# Altium schematic sheet DAC_OutFilter.SchDoc
size A4; SheetNumber: 7; SheetTotal: 8
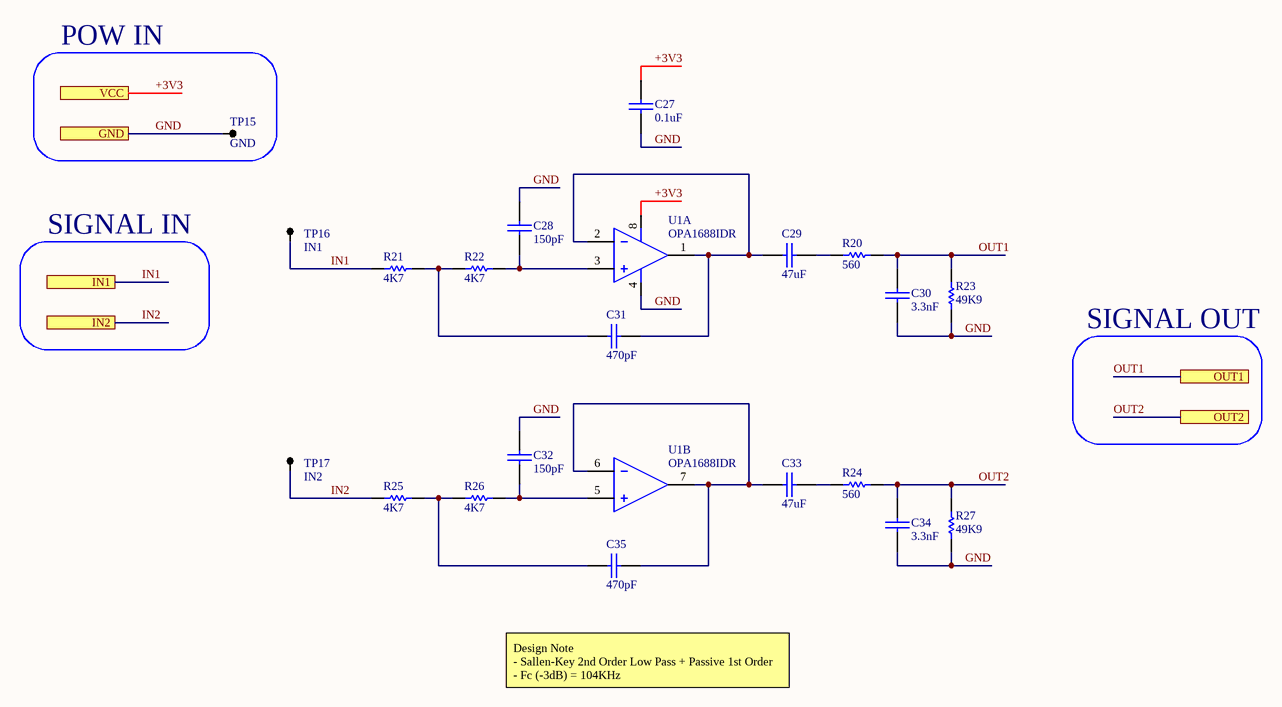
[diagram p0: DAC_OutFilter.SchDoc]

## Parts
C27  0.1uF  [0402-CAP-TDK]
C28  150pF  [0402-CAP-TDK]
C29  47uF  [1206-CAP-TDK]
C30  3.3nF  [0402-CAP-TDK]
C31  470pF  [0402-CAP-TDK]
C32  150pF  [0402-CAP-TDK]
C33  47uF  [1206-CAP-TDK]
C34  3.3nF  [0402-CAP-TDK]
C35  470pF  [0402-CAP-TDK]
R20  560  [0603-RES-PANASONIC]
R21  4K7  [0402-RES-PANASONIC]
R22  4K7  [0402-RES-PANASONIC]
R23  49K9  [0402-RES-PANASONIC]
R24  560  [0603-RES-PANASONIC]
R25  4K7  [0402-RES-PANASONIC]
R26  4K7  [0402-RES-PANASONIC]
R27  49K9  [0402-RES-PANASONIC]
TP15  GND  [534-5280]
TP16  IN1  [534-5280]
TP17  IN2  [534-5280]
U1  OPA1688IDR  [TI-SOIC-8]  (parts A,B of 2)

## Blocks framed on the sheet
POW IN: TP15

## Ports
GND, IN1, IN2, OUT1, OUT2, VCC

## Nets
+3V3: C27.2 U1.8(VDD) ; port VCC
GND: C27.1 C28.1 C30.2 C32.1 C34.2 R23.1 R27.1 TP15.1 U1.4(GND) ; port GND
IN1: R21.1 TP16.1 ; port IN1
IN2: R25.1 TP17.1 ; port IN2
OUT1: C30.1 R20.2 R23.2 ; port OUT1
OUT2: C34.1 R24.2 R27.2 ; port OUT2
NetC28_2: C28.2 R22.2 U1.3(1IN+)
NetC29_1: C29.1 R20.1
NetC29_2: C29.2 C31.1 U1.1(1OUT) U1.2(1IN-)
NetC31_2: C31.2 R21.2 R22.1
NetC32_2: C32.2 R26.2 U1.5(2IN+)
NetC33_1: C33.1 R24.1
NetC33_2: C33.2 C35.1 U1.6(2IN-) U1.7(2OUT)
NetC35_2: C35.2 R25.2 R26.1

## Notes on the sheet
- SIGNAL IN
- SIGNAL OUT
- Design Note
  - Sallen-Key 2nd Order Low Pass + Passive 1st Order
  - Fc (-3dB) = 104KHz

## Library data of the parts
C27-C35 = CAP-SMD
  C27: JLCPart: C307331
R20-R27 = RES-SMD
TP15-TP17 = TP-CLAW
U1 = OPA1688IDR: Rail-To-Rail Amplifier 2 Circuit - 8-SOIC